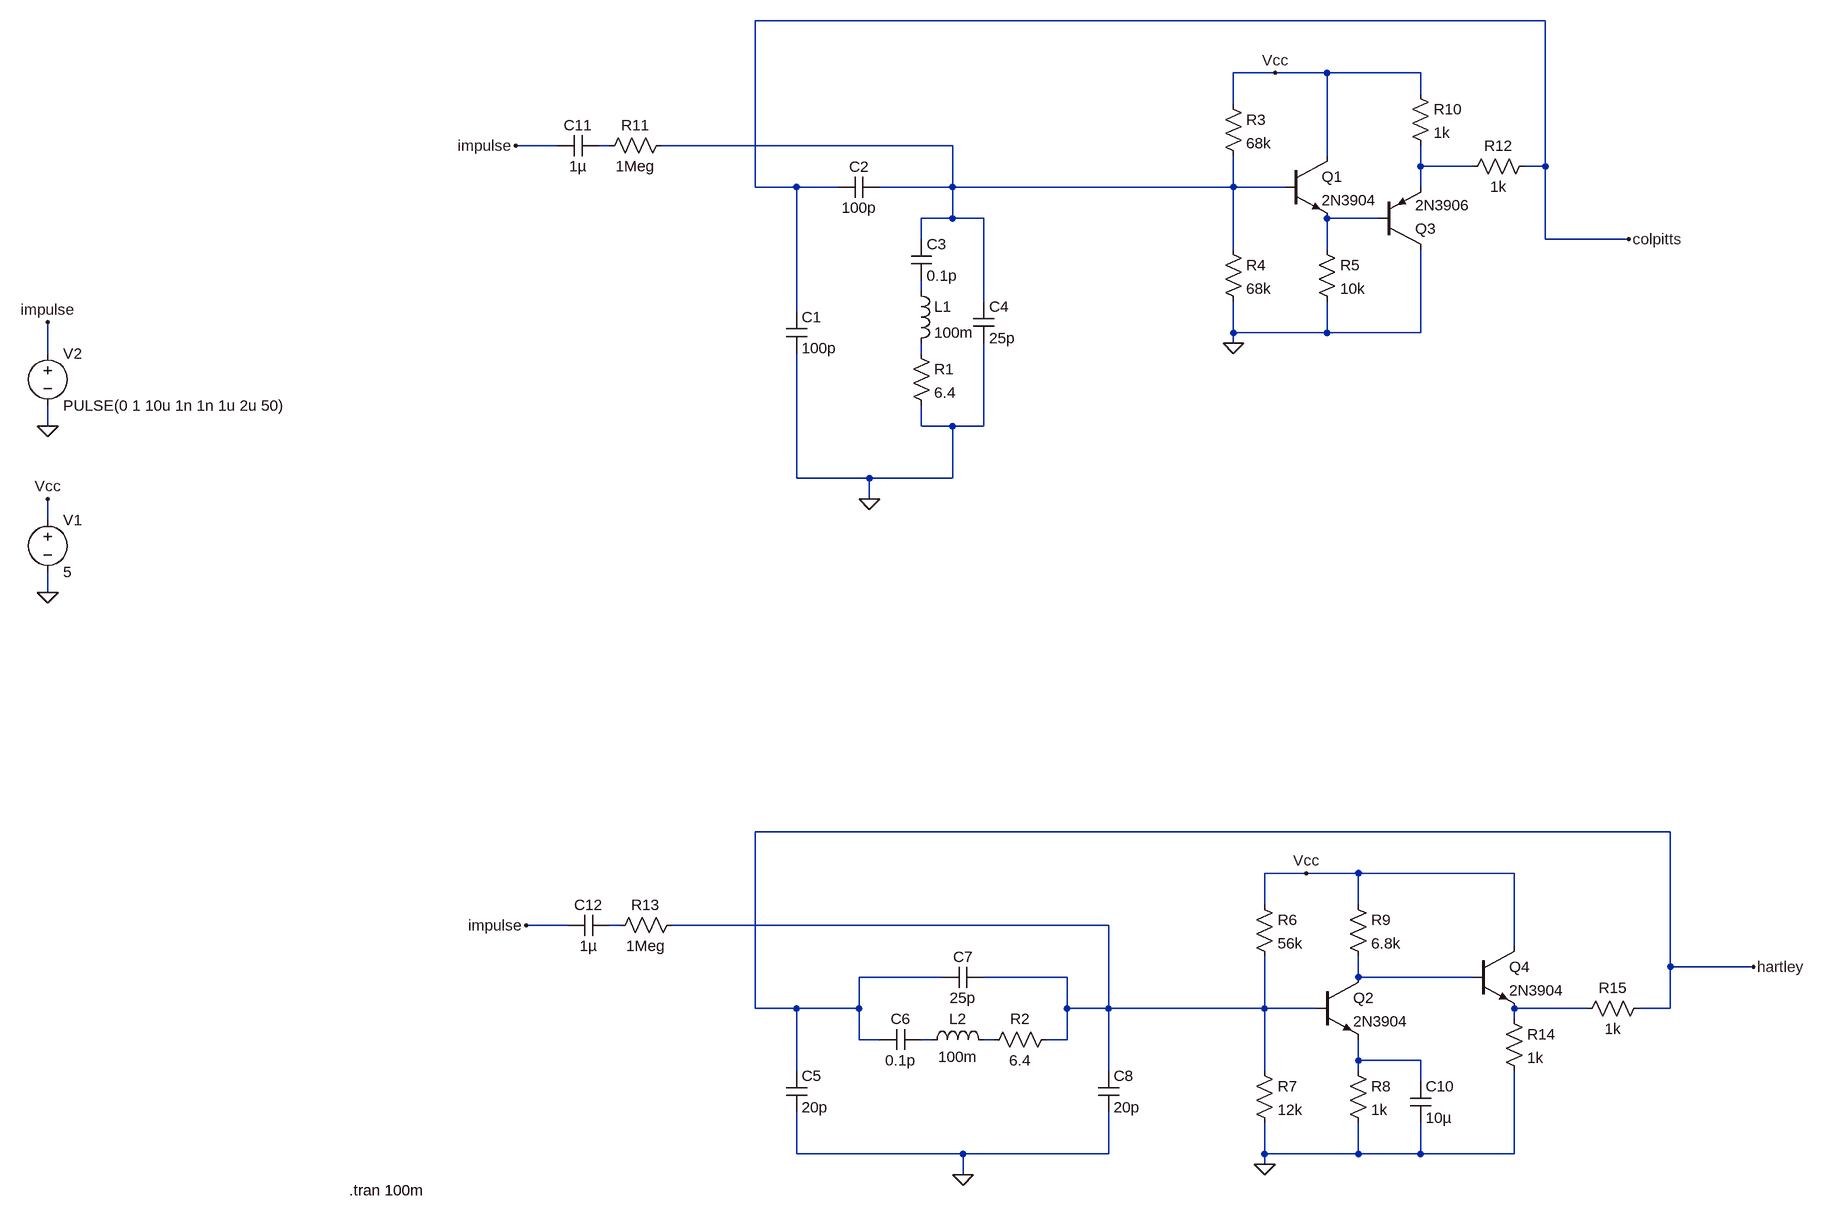
[diagram p0: schematic colpitts_oscillator.asc]
colpitts_oscillator.asc, the LTspice schematic file:
Version 4
SHEET 1 1668 1176
WIRE 1232 -640 16 -640
WIRE 816 -560 752 -560
WIRE 896 -560 816 -560
WIRE 1040 -560 896 -560
WIRE 1040 -528 1040 -560
WIRE 752 -512 752 -560
WIRE -288 -448 -352 -448
WIRE -208 -448 -224 -448
WIRE 320 -448 -128 -448
WIRE 896 -432 896 -560
WIRE 1040 -416 1040 -448
WIRE 1120 -416 1040 -416
WIRE 1232 -416 1232 -640
WIRE 1232 -416 1200 -416
WIRE 16 -384 16 -640
WIRE 80 -384 16 -384
WIRE 144 -384 80 -384
WIRE 320 -384 320 -448
WIRE 320 -384 208 -384
WIRE 752 -384 752 -432
WIRE 752 -384 320 -384
WIRE 832 -384 752 -384
WIRE 1040 -384 1040 -416
WIRE 320 -336 320 -384
WIRE 320 -336 272 -336
WIRE 368 -336 320 -336
WIRE 976 -336 896 -336
WIRE 272 -304 272 -336
WIRE 1232 -304 1232 -416
WIRE 1360 -304 1232 -304
WIRE 752 -288 752 -384
WIRE 896 -288 896 -336
WIRE 272 -224 272 -240
WIRE 368 -208 368 -336
WIRE 80 -192 80 -384
WIRE 752 -160 752 -208
WIRE 896 -160 896 -208
WIRE 896 -160 752 -160
WIRE 1040 -160 1040 -288
WIRE 1040 -160 896 -160
WIRE 752 -144 752 -160
WIRE -1072 -128 -1072 -176
WIRE 272 -128 272 -144
WIRE -1072 -16 -1072 -48
WIRE 272 -16 272 -48
WIRE 320 -16 272 -16
WIRE 368 -16 368 -144
WIRE 368 -16 320 -16
WIRE 80 64 80 -128
WIRE 192 64 80 64
WIRE 320 64 320 -16
WIRE 320 64 192 64
WIRE 192 96 192 64
WIRE -1072 128 -1072 96
WIRE -1072 240 -1072 208
WIRE 1424 608 16 608
WIRE 864 672 800 672
WIRE 944 672 864 672
WIRE 1184 672 944 672
WIRE 800 720 800 672
WIRE 944 720 944 672
WIRE -272 752 -336 752
WIRE -192 752 -208 752
WIRE 560 752 -112 752
WIRE 1184 784 1184 672
WIRE 1424 816 1424 608
WIRE 1552 816 1424 816
WIRE 304 832 176 832
WIRE 496 832 368 832
WIRE 944 832 944 800
WIRE 1120 832 944 832
WIRE 16 880 16 608
WIRE 80 880 16 880
WIRE 176 880 176 832
WIRE 176 880 80 880
WIRE 496 880 496 832
WIRE 560 880 560 752
WIRE 560 880 496 880
WIRE 800 880 800 800
WIRE 800 880 560 880
WIRE 880 880 800 880
WIRE 1296 880 1184 880
WIRE 1424 880 1424 816
WIRE 1424 880 1376 880
WIRE 1184 896 1184 880
WIRE 176 928 176 880
WIRE 208 928 176 928
WIRE 288 928 272 928
WIRE 384 928 368 928
WIRE 496 928 496 880
WIRE 496 928 464 928
WIRE 944 960 944 928
WIRE 1040 960 944 960
WIRE 80 976 80 880
WIRE 560 976 560 880
WIRE 800 976 800 880
WIRE 944 976 944 960
WIRE 1040 992 1040 960
WIRE 80 1104 80 1040
WIRE 336 1104 80 1104
WIRE 560 1104 560 1040
WIRE 560 1104 336 1104
WIRE 800 1104 800 1056
WIRE 944 1104 944 1056
WIRE 944 1104 800 1104
WIRE 1040 1104 1040 1056
WIRE 1040 1104 944 1104
WIRE 1184 1104 1184 976
WIRE 1184 1104 1040 1104
WIRE 800 1120 800 1104
WIRE 336 1136 336 1104
FLAG -1072 240 0
FLAG -1072 96 Vcc
FLAG 752 -144 0
FLAG 192 96 0
FLAG 816 -560 Vcc
FLAG 800 1120 0
FLAG 864 672 Vcc
FLAG 336 1136 0
FLAG -1072 -16 0
FLAG -1072 -176 impulse
FLAG -352 -448 impulse
FLAG -336 752 impulse
FLAG 1360 -304 colpitts
FLAG 1552 816 hartley
SYMBOL cap 64 -192 R0
SYMATTR InstName C1
SYMATTR Value 100p
SYMBOL cap 208 -400 R90
WINDOW 0 0 32 VBottom 2
WINDOW 3 32 32 VTop 2
SYMATTR InstName C2
SYMATTR Value 100p
SYMBOL res 256 -144 R0
SYMATTR InstName R1
SYMATTR Value 6.4
SYMBOL cap 256 -304 R0
SYMATTR InstName C3
SYMATTR Value 0.1p
SYMBOL ind 256 -240 R0
SYMATTR InstName L1
SYMATTR Value 100m
SYMBOL cap 352 -208 R0
SYMATTR InstName C4
SYMATTR Value 25p
SYMBOL cap 64 976 R0
SYMATTR InstName C5
SYMATTR Value 20p
SYMBOL res 368 944 R270
WINDOW 0 32 56 VTop 2
WINDOW 3 0 56 VBottom 2
SYMATTR InstName R2
SYMATTR Value 6.4
SYMBOL cap 208 944 R270
WINDOW 0 32 32 VTop 2
WINDOW 3 0 32 VBottom 2
SYMATTR InstName C6
SYMATTR Value 0.1p
SYMBOL ind 272 944 R270
WINDOW 0 32 56 VTop 2
WINDOW 3 5 56 VBottom 2
SYMATTR InstName L2
SYMATTR Value 100m
SYMBOL cap 304 848 R270
WINDOW 0 32 32 VTop 2
WINDOW 3 0 32 VBottom 2
SYMATTR InstName C7
SYMATTR Value 25p
SYMBOL cap 544 976 R0
SYMATTR InstName C8
SYMATTR Value 20p
SYMBOL npn 832 -432 R0
SYMATTR InstName Q1
SYMATTR Value 2N3904
SYMBOL voltage -1072 112 R0
WINDOW 123 0 0 Left 0
WINDOW 39 0 0 Left 0
SYMATTR InstName V1
SYMATTR Value 5
SYMBOL res 736 -528 R0
SYMATTR InstName R3
SYMATTR Value 68k
SYMBOL res 736 -304 R0
SYMATTR InstName R4
SYMATTR Value 68k
SYMBOL res 880 -304 R0
SYMATTR InstName R5
SYMATTR Value 10k
SYMBOL npn 880 832 R0
SYMATTR InstName Q2
SYMATTR Value 2N3904
SYMBOL res 784 704 R0
SYMATTR InstName R6
SYMATTR Value 56k
SYMBOL res 784 960 R0
SYMATTR InstName R7
SYMATTR Value 12k
SYMBOL res 928 960 R0
SYMATTR InstName R8
SYMATTR Value 1k
SYMBOL res 928 704 R0
SYMATTR InstName R9
SYMATTR Value 6.8k
SYMBOL cap 1024 992 R0
SYMATTR InstName C10
SYMATTR Value 10µ
SYMBOL res -112 -464 R90
WINDOW 0 0 56 VBottom 2
WINDOW 3 32 56 VTop 2
SYMATTR InstName R11
SYMATTR Value 1Meg
SYMBOL voltage -1072 -144 R0
WINDOW 123 0 0 Left 0
WINDOW 39 0 0 Left 0
SYMATTR InstName V2
SYMATTR Value PULSE(0 1 10u 1n 1n 1u 2u 50)
SYMBOL cap -288 -432 R270
WINDOW 0 32 32 VTop 2
WINDOW 3 0 32 VBottom 2
SYMATTR InstName C11
SYMATTR Value 1µ
SYMBOL res -96 736 R90
WINDOW 0 0 56 VBottom 2
WINDOW 3 32 56 VTop 2
SYMATTR InstName R13
SYMATTR Value 1Meg
SYMBOL cap -272 768 R270
WINDOW 0 32 32 VTop 2
WINDOW 3 0 32 VBottom 2
SYMATTR InstName C12
SYMATTR Value 1µ
SYMBOL pnp 976 -288 M180
SYMATTR InstName Q3
SYMATTR Value 2N3906
SYMBOL res 1024 -544 R0
SYMATTR InstName R10
SYMATTR Value 1k
SYMBOL res 1216 -432 R90
WINDOW 0 0 56 VBottom 2
WINDOW 3 32 56 VTop 2
SYMATTR InstName R12
SYMATTR Value 1k
SYMBOL npn 1120 784 R0
SYMATTR InstName Q4
SYMATTR Value 2N3904
SYMBOL res 1168 880 R0
SYMATTR InstName R14
SYMATTR Value 1k
SYMBOL res 1392 864 R90
WINDOW 0 0 56 VBottom 2
WINDOW 3 32 56 VTop 2
SYMATTR InstName R15
SYMATTR Value 1k
TEXT -608 1160 Left 2 !.tran 100m

The netlist it stands for:
* colpitts_oscillator.asc
C1 colpitts 0 100p
C2 N002 colpitts 100p
R1 N006 0 6.4
C3 N002 N005 0.1p
L1 N005 N006 100m
C4 N002 0 25p
C5 hartley 0 20p
R2 N012 N008 6.4
C6 hartley N011 0.1p
L2 N011 N012 100m
C7 hartley N008 25p
C8 N008 0 20p
Q1 Vcc N002 N004 0 2N3904
V1 Vcc 0 5
R3 Vcc N002 68k
R4 N002 0 68k
R5 N004 0 10k
Q2 N009 N008 N013 0 2N3904
R6 Vcc N008 56k
R7 N008 0 12k
R8 N013 0 1k
R9 Vcc N009 6.8k
C10 N013 0 10µ
R11 N002 N001 1Meg
V2 impulse 0 PULSE(0 1 10u 1n 1n 1u 2u 50)
C11 impulse N001 1µ
R13 N008 N007 1Meg
C12 impulse N007 1µ
Q3 0 N004 N003 0 2N3906
R10 Vcc N003 1k
R12 colpitts N003 1k
Q4 Vcc N009 N010 0 2N3904
R14 N010 0 1k
R15 hartley N010 1k
.model NPN NPN
.model PNP PNP
.lib standard.bjt
.tran 100m
.backanno
.end